# Altium project novena_evt1.PrjPcb (part 4 of 4)

## Sheet 15fpga.SchDoc
size C
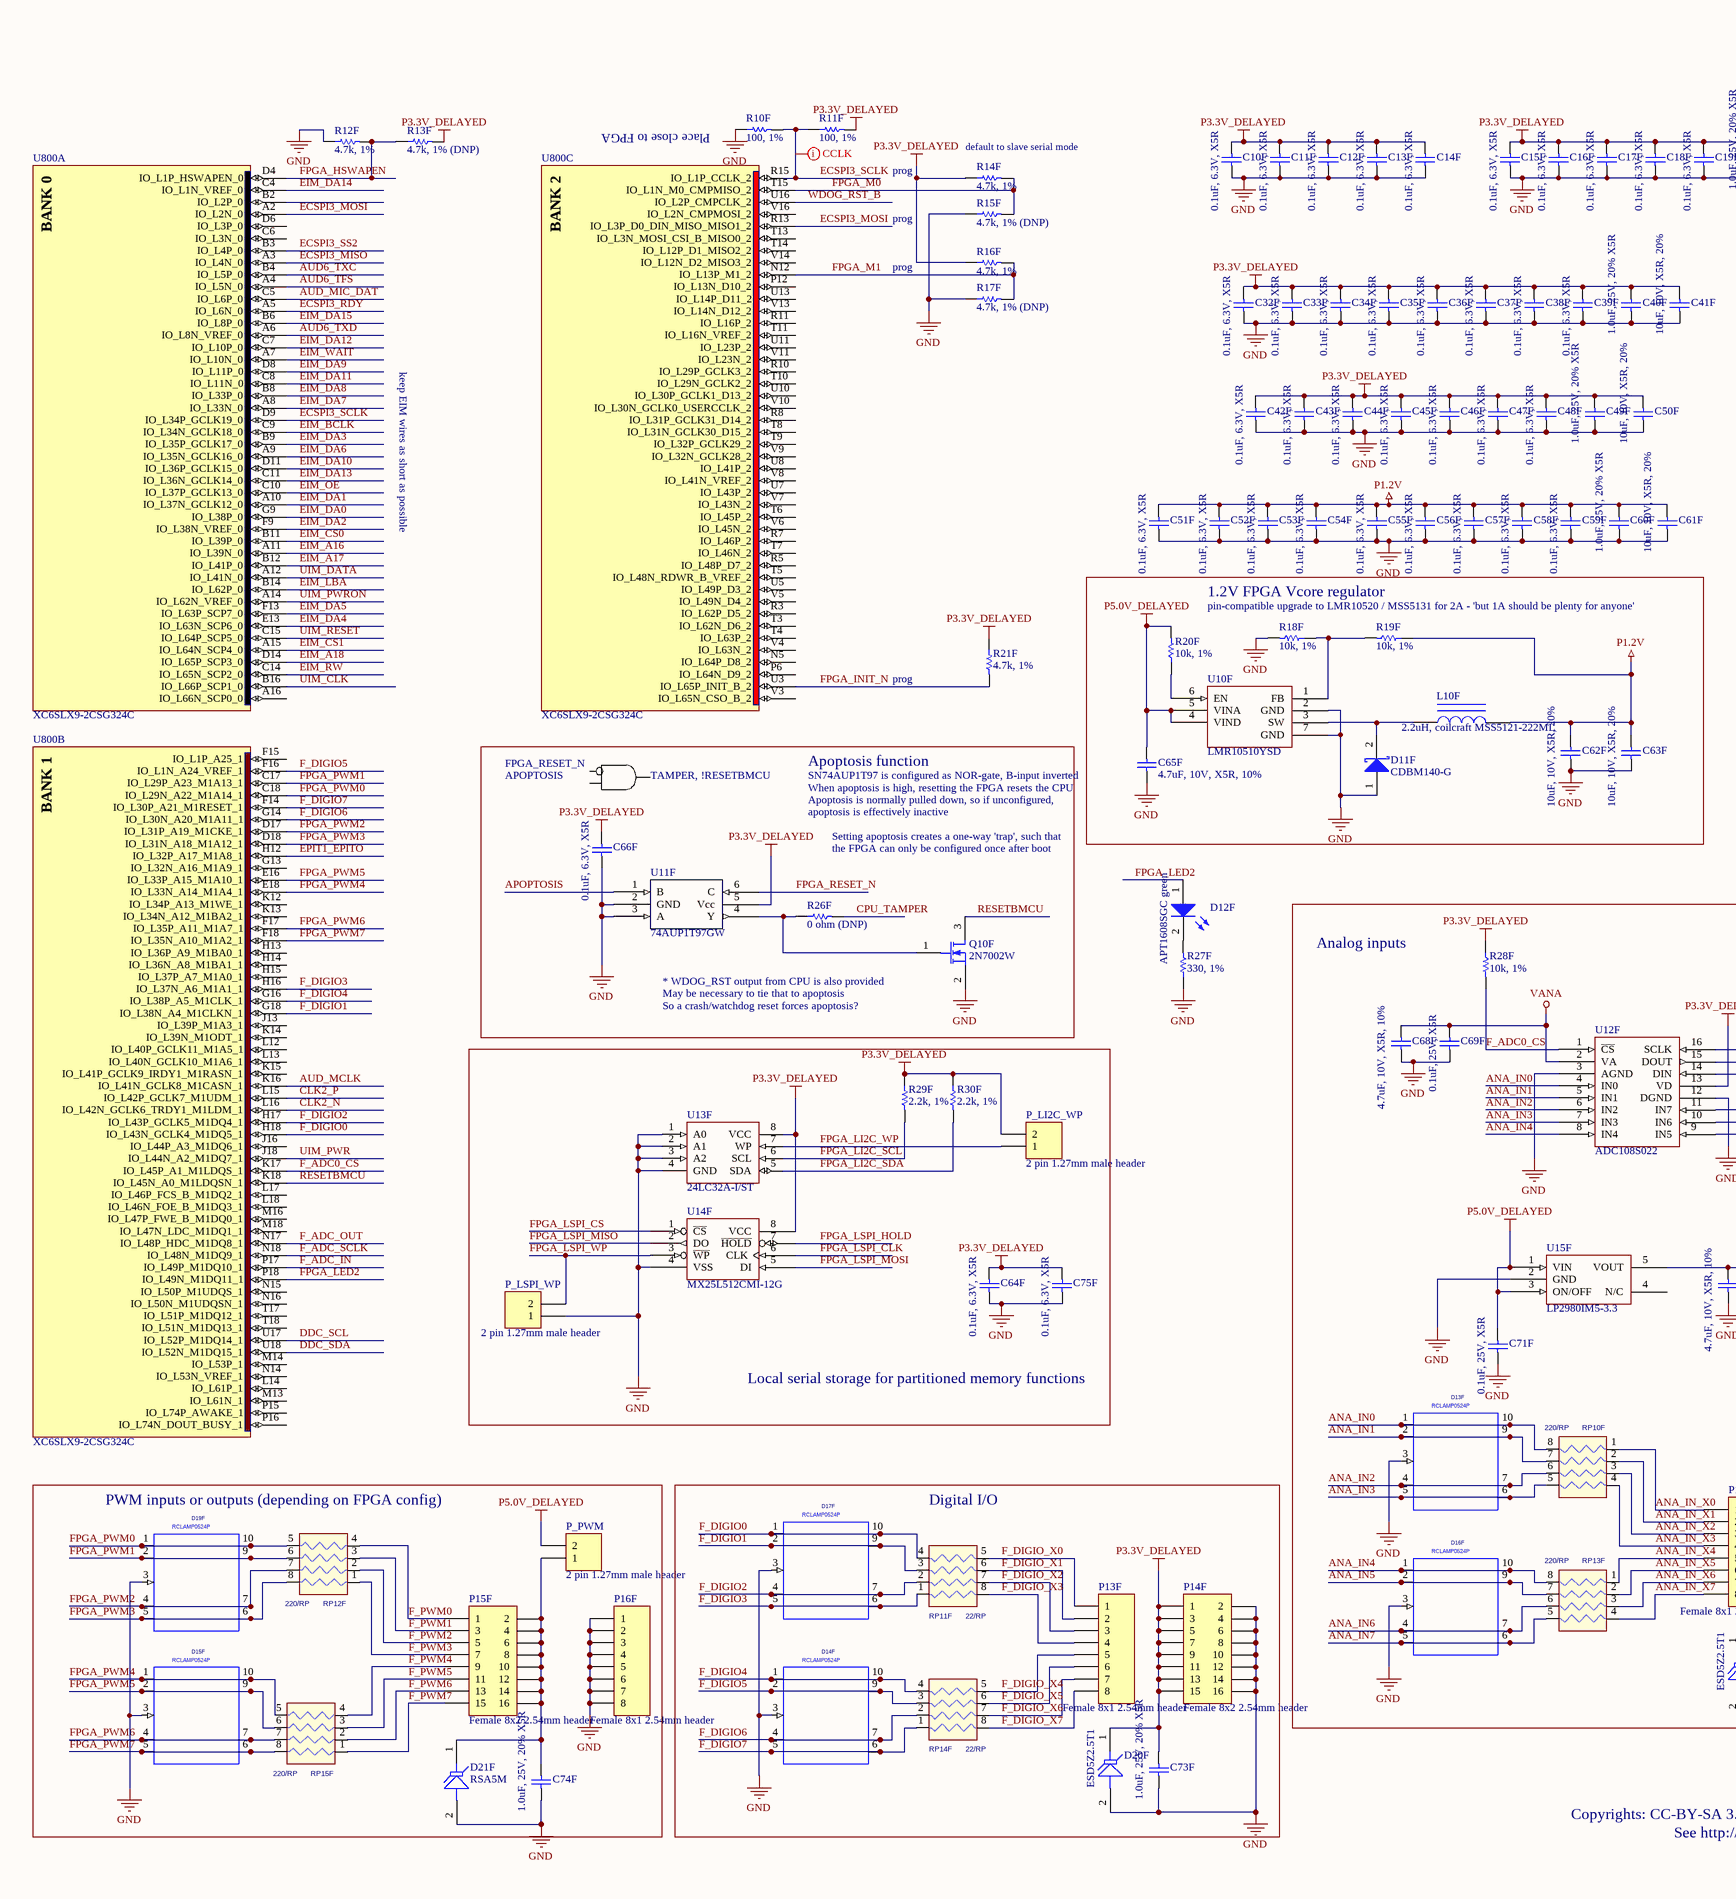
[diagram p16: 15fpga.SchDoc, left]
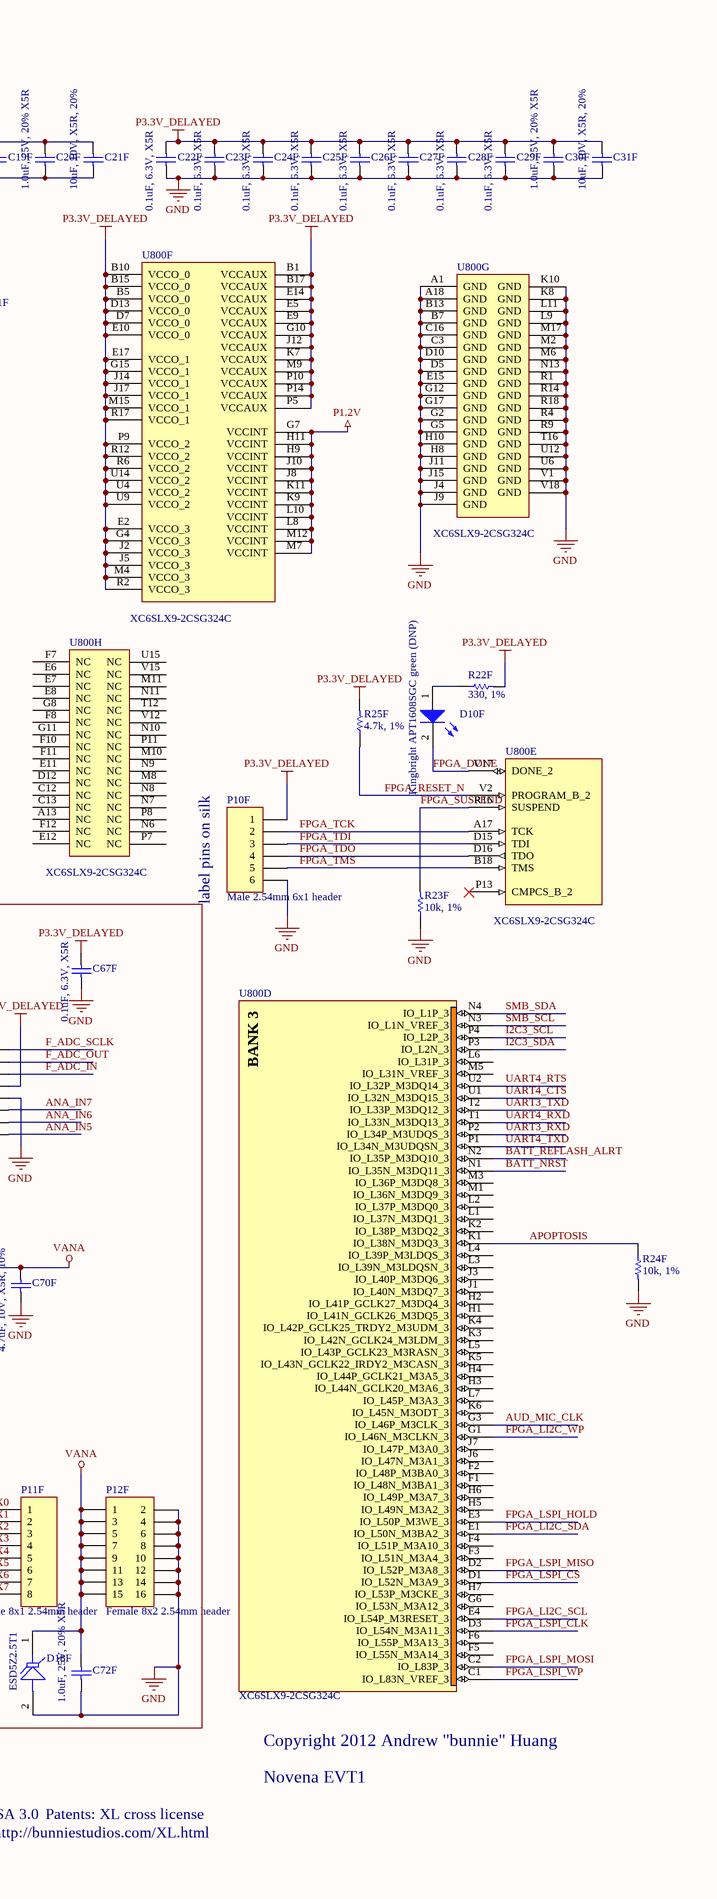
[diagram p17: 15fpga.SchDoc, right]

### Parts
C10F  0.1uF, 6.3V, X5R  [CAPC0603N_B]
C11F  0.1uF, 6.3V, X5R  [CAPC0603N_B]
C12F  0.1uF, 6.3V, X5R  [CAPC0603N_B]
C13F  0.1uF, 6.3V, X5R  [CAPC0603N_B]
C14F  0.1uF, 6.3V, X5R  [CAPC0603N_B]
C15F  0.1uF, 6.3V, X5R  [CAPC0603N_B]
C16F  0.1uF, 6.3V, X5R  [CAPC0603N_B]
C17F  0.1uF, 6.3V, X5R  [CAPC0603N_B]
C18F  0.1uF, 6.3V, X5R  [CAPC0603N_B]
C19F  0.1uF, 6.3V, X5R  [CAPC0603N_B]
C20F  1.0uF, 25V, 20% X5R  [CAPC1608N]
C21F  10uF, 10V, X5R, 20%  [CAPC1608N]
C22F  0.1uF, 6.3V, X5R  [CAPC0603N_B]
C23F  0.1uF, 6.3V, X5R  [CAPC0603N_B]
C24F  0.1uF, 6.3V, X5R  [CAPC0603N_B]
C25F  0.1uF, 6.3V, X5R  [CAPC0603N_B]
C26F  0.1uF, 6.3V, X5R  [CAPC0603N_B]
C27F  0.1uF, 6.3V, X5R  [CAPC0603N_B]
C28F  0.1uF, 6.3V, X5R  [CAPC0603N_B]
C29F  0.1uF, 6.3V, X5R  [CAPC0603N_B]
C30F  1.0uF, 25V, 20% X5R  [CAPC1608N]
C31F  10uF, 10V, X5R, 20%  [CAPC1608N]
C32F  0.1uF, 6.3V, X5R  [CAPC0603N_B]
C33F  0.1uF, 6.3V, X5R  [CAPC0603N_B]
C34F  0.1uF, 6.3V, X5R  [CAPC0603N_B]
C35F  0.1uF, 6.3V, X5R  [CAPC0603N_B]
C36F  0.1uF, 6.3V, X5R  [CAPC0603N_B]
C37F  0.1uF, 6.3V, X5R  [CAPC0603N_B]
C38F  0.1uF, 6.3V, X5R  [CAPC0603N_B]
C39F  0.1uF, 6.3V, X5R  [CAPC0603N_B]
C40F  1.0uF, 25V, 20% X5R  [CAPC1608N]
C41F  10uF, 10V, X5R, 20%  [CAPC1608N]
C42F  0.1uF, 6.3V, X5R  [CAPC0603N_B]
C43F  0.1uF, 6.3V, X5R  [CAPC0603N_B]
C44F  0.1uF, 6.3V, X5R  [CAPC0603N_B]
C45F  0.1uF, 6.3V, X5R  [CAPC0603N_B]
C46F  0.1uF, 6.3V, X5R  [CAPC0603N_B]
C47F  0.1uF, 6.3V, X5R  [CAPC0603N_B]
C48F  0.1uF, 6.3V, X5R  [CAPC0603N_B]
C49F  1.0uF, 25V, 20% X5R  [CAPC1608N]
C50F  10uF, 10V, X5R, 20%  [CAPC1608N]
C51F  0.1uF, 6.3V, X5R  [CAPC0603N_B]
C52F  0.1uF, 6.3V, X5R  [CAPC0603N_B]
C53F  0.1uF, 6.3V, X5R  [CAPC0603N_B]
C54F  0.1uF, 6.3V, X5R  [CAPC0603N_B]
C55F  0.1uF, 6.3V, X5R  [CAPC0603N_B]
C56F  0.1uF, 6.3V, X5R  [CAPC0603N_B]
C57F  0.1uF, 6.3V, X5R  [CAPC0603N_B]
C58F  0.1uF, 6.3V, X5R  [CAPC0603N_B]
C59F  0.1uF, 6.3V, X5R  [CAPC0603N_B]
C60F  1.0uF, 25V, 20% X5R  [CAPC1608N]
C61F  10uF, 10V, X5R, 20%  [CAPC1608N]
C62F  10uF, 10V, X5R, 20%  [CAPC1608N]
C63F  10uF, 10V, X5R, 20%  [CAPC1608N]
C64F  0.1uF, 6.3V, X5R  [CAPC0603N_B]
C65F  4.7uF, 10V, X5R, 10%  [CAPC1608N]
C66F  0.1uF, 6.3V, X5R  [CAPC0603N_B]
C67F  0.1uF, 6.3V, X5R  [CAPC0603N_B]
C68F  4.7uF, 10V, X5R, 10%  [CAPC1608N]
C69F  0.1uF, 25V, X5R  [CAPC1005N]
C70F  4.7uF, 10V, X5R, 10%  [CAPC1608N]
C71F  0.1uF, 25V, X5R  [CAPC1005N]
C72F  1.0uF, 25V, 20% X5R  [CAPC1608N]
C73F  1.0uF, 25V, 20% X5R  [CAPC1608N]
C74F  1.0uF, 25V, 20% X5R  [CAPC1608N]
C75F  0.1uF, 6.3V, X5R  [CAPC0603N_B]
D10F  Kingbright APT1608SGC green (DNP)  [CD1608-0603]
D11F  CDBM140-G  [SOD123]
D12F  APT1608SGC green  [CD1608-0603]
D13F  RCLAMP0524P  [SEMTECH_SLP2510P8]  (value not drawn)
D14F  RCLAMP0524P  [SEMTECH_SLP2510P8]  (value not drawn)
D15F  RCLAMP0524P  [SEMTECH_SLP2510P8]  (value not drawn)
D16F  RCLAMP0524P  [SEMTECH_SLP2510P8]  (value not drawn)
D17F  RCLAMP0524P  [SEMTECH_SLP2510P8]  (value not drawn)
D18F  ESD5Z2.5T1  [SOD-523]
D19F  RCLAMP0524P  [SEMTECH_SLP2510P8]  (value not drawn)
D20F  ESD5Z2.5T1  [SOD-523]
D21F  RSA5M  [SOD123/X.85]
L10F  2.2uH, coilcraft MSS5121-222ML  [COILCRAFT_MSS5121]
P10F  Male 2.54mm 6x1 header  [HDR1X6]
P11F  Female 8x1 2.54mm header  [HDR1X8]
P12F  Female 8x2 2.54mm header  [HDR2X8]
P13F  Female 8x1 2.54mm header  [HDR1X8]
P14F  Female 8x2 2.54mm header  [HDR2X8]
P15F  Female 8x2 2.54mm header  [HDR2X8]
P16F  Female 8x1 2.54mm header  [HDR1X8]
P_LI2C_WP  2 pin 1.27mm male header  [HEADER_2_1.27MM]
P_LSPI_WP  2 pin 1.27mm male header  [HEADER_2_1.27MM]
P_PWM  2 pin 1.27mm male header  [HEADER_2_1.27MM]
Q10F  2N7002W  [SOT323-3AN]
R10F  100, 1%  [RESC1005N]
R11F  100, 1%  [RESC1005N]
R12F  4.7k, 1%  [RESC1005N]
R13F  4.7k, 1% (DNP)  [RESC1005N]
R14F  4.7k, 1%  [RESC1005N]
R15F  4.7k, 1% (DNP)  [RESC1005N]
R16F  4.7k, 1%  [RESC1005N]
R17F  4.7k, 1% (DNP)  [RESC1005N]
R18F  10k, 1%  [RESC1005N]
R19F  10k, 1%  [RESC1005N]
R20F  10k, 1%  [RESC1005N]
R21F  4.7k, 1%  [RESC1005N]
R22F  330, 1%  [RESC1005N]
R23F  10k, 1%  [RESC1005N]
R24F  10k, 1%  [RESC1005N]
R25F  4.7k, 1%  [RESC1005N]
R26F  0 ohm (DNP)  [RESC1005N]
R27F  330, 1%  [RESC1005N]
R28F  10k, 1%  [RESC1005N]
R29F  2.2k, 1%  [RESC1005N]
R30F  2.2k, 1%  [RESC1005N]
RP10F  220/RP  [PANASONIC_EXB28V]
RP11F  22/RP  [PANASONIC_EXB28V]
RP12F  220/RP  [PANASONIC_EXB28V]
RP13F  220/RP  [PANASONIC_EXB28V]
RP14F  22/RP  [PANASONIC_EXB28V]
RP15F  220/RP  [PANASONIC_EXB28V]
U10F  LMR10510YSD  [SON95P300X300X80-7V]
U11F  74AUP1T97GW  [SOT363-6N]
U12F  ADC108S022  [SOP65P640-16N]
U13F  24LC32A-I/ST  [TSOP65P640-8AN]
U14F  MX25L512CMI-12G  [SOIC127P600-8AN]
U15F  LP2980IM5-3.3  [SOT23-5AN]
U800  XC6SLX9-2CSG324C  [CSG324]  (parts A,B,C,D,E,F,G,H of 8)

### Blocks framed on the sheet
1.2V FPGA Vcore regulator: C62F C63F C65F D11F L10F R18F R19F R20F U10F
Apoptosis function: C66F Q10F R26F U11F
Analog inputs: C67F C68F C69F C70F C71F C72F D13F D16F D18F P11F P12F R28F RP10F RP13F U12F U15F
Local serial storage for partitioned memory functions: C64F C75F P_LI2C_WP P_LSPI_WP R29F R30F U13F U14F
PWM inputs or outputs (depending on FPGA config): C74F D15F D19F D21F P15F P16F P_PWM RP12F RP15F
Digital I/O: C73F D14F D17F D20F P13F P14F RP11F RP14F

### Nets
GND: C10F.2 C11F.2 C12F.2 C13F.2 C14F.2 C15F.2 C16F.2 C17F.2 C18F.2 C19F.2 C20F.1 C21F.2 C22F.2 C23F.2 C24F.2 C25F.2 C26F.2 C27F.2 C28F.2 C29F.2 C30F.1 C31F.2 C32F.2 C33F.2 C34F.2 C35F.2 C36F.2 C37F.2 C38F.2 C39F.2 C40F.1 C41F.2 C42F.2 C43F.2 C44F.2 C45F.2 C46F.2 C47F.2 C48F.2 C49F.1 C50F.2 C51F.2 C52F.2 C53F.2 C54F.2 C55F.2 C56F.2 C57F.2 C58F.2 C59F.2 C60F.1 C61F.2 C62F.1 C63F.1 C64F.2 C65F.2 C66F.2 C67F.2 C68F.2 C69F.2 C70F.2 C71F.2 C72F.1 C73F.1 C74F.1 C75F.2 D11F.1(A) D13F.3(GND1) D14F.3(GND1) D15F.3(GND1) D16F.3(GND1) D17F.3(GND1) D18F.2(A) D19F.3(GND1) D20F.2(A) D21F.2(A) P10F.6 P12F.2 P12F.4 P12F.6 P12F.8 P12F.10 P12F.12 P12F.14 P12F.16 P14F.2 P14F.4 P14F.6 P14F.8 P14F.10 P14F.12 P14F.14 P14F.16 P16F.1 P16F.2 P16F.3 P16F.4 P16F.5 P16F.6 P16F.7 P16F.8 P_LSPI_WP.1 Q10F.2(S) R10F.1 R12F.1 R15F.1 R17F.1 R18F.2 R23F.1 R24F.2 R27F.1 U10F.2(GND) U10F.7(GND) U11F.2(GND) U11F.3(A) U12F.3(AGND) U12F.12(DGND) U13F.1(A0) U13F.2(A1) U13F.3(A2) U13F.4(GND) U14F.4(VSS) U15F.2(GND) U800.A1(GND) U800.A18(GND) U800.B7(GND) U800.B13(GND) U800.C3(GND) U800.C16(GND) U800.D5(GND) U800.D10(GND) U800.E15(GND) U800.G2(GND) U800.G5(GND) U800.G12(GND) U800.G17(GND) U800.H8(GND) U800.H10(GND) U800.J4(GND) U800.J9(GND) U800.J11(GND) U800.J15(GND) U800.K8(GND) U800.K10(GND) U800.L9(GND) U800.L11(GND) U800.M2(GND) U800.M6(GND) U800.M17(GND) U800.N13(GND) U800.R1(GND) U800.R4(GND) U800.R9(GND) U800.R14(GND) U800.R18(GND) U800.T16(GND) U800.U6(GND) U800.U12(GND) U800.V1(GND) U800.V18(GND)
P1.2V: C51F.1 C52F.1 C53F.1 C54F.1 C55F.1 C56F.1 C57F.1 C58F.1 C59F.1 C60F.2 C61F.1 C62F.2 C63F.2 L10F.2 R19F.1 U800.G7(VCCINT) U800.H9(VCCINT) U800.H11(VCCINT) U800.J8(VCCINT) U800.J10(VCCINT) U800.K9(VCCINT) U800.K11(VCCINT) U800.L8(VCCINT) U800.L10(VCCINT) U800.M7(VCCINT) U800.M12(VCCINT)
P3.3V_DELAYED: C10F.1 C11F.1 C12F.1 C13F.1 C14F.1 C15F.1 C16F.1 C17F.1 C18F.1 C19F.1 C20F.2 C21F.1 C22F.1 C23F.1 C24F.1 C25F.1 C26F.1 C27F.1 C28F.1 C29F.1 C30F.2 C31F.1 C32F.1 C33F.1 C34F.1 C35F.1 C36F.1 C37F.1 C38F.1 C39F.1 C40F.2 C41F.1 C42F.1 C43F.1 C44F.1 C45F.1 C46F.1 C47F.1 C48F.1 C49F.2 C50F.1 C64F.1 C66F.1 C67F.1 C73F.2 C75F.1 D20F.1(K) P10F.1 P14F.1 P14F.3 P14F.5 P14F.7 P14F.9 P14F.11 P14F.13 P14F.15 P_LI2C_WP.2 R11F.2 R13F.2 R14F.1 R16F.1 R21F.1 R22F.2 R25F.2 R28F.1 R29F.1 R30F.1 U11F.5(Vcc) U12F.13(VD) U13F.8(VCC) U14F.8(VCC) U800.B1(VCCAUX) U800.B5(VCCO_0) U800.B10(VCCO_0) U800.B15(VCCO_0) U800.B17(VCCAUX) U800.D7(VCCO_0) U800.D13(VCCO_0) U800.E2(VCCO_3) U800.E5(VCCAUX) U800.E9(VCCAUX) U800.E10(VCCO_0) U800.E14(VCCAUX) U800.E17(VCCO_1) U800.G4(VCCO_3) U800.G10(VCCAUX) U800.G15(VCCO_1) U800.J2(VCCO_3) U800.J5(VCCO_3) U800.J12(VCCAUX) U800.J14(VCCO_1) U800.J17(VCCO_1) U800.K7(VCCAUX) U800.M4(VCCO_3) U800.M9(VCCAUX) U800.M15(VCCO_1) U800.P5(VCCAUX) U800.P9(VCCO_2) U800.P10(VCCAUX) U800.P14(VCCAUX) U800.R2(VCCO_3) U800.R6(VCCO_2) U800.R12(VCCO_2) U800.R17(VCCO_1) U800.U4(VCCO_2) U800.U9(VCCO_2) U800.U14(VCCO_2)
P5.0V_DELAYED: C65F.1 C71F.1 P_PWM.2 R20F.2 U10F.4(VIND) U10F.5(VINA) U15F.1(VIN) U15F.3(ON/OFF)
VANA: C68F.1 C69F.1 C70F.1 C72F.2 D18F.1(K) P12F.1 P12F.3 P12F.5 P12F.7 P12F.9 P12F.11 P12F.13 P12F.15 U12F.2(VA) U15F.5(VOUT)
ANA_IN0: D13F.1(IO1A) D13F.10(IO1B) RP10F.8(R12) U12F.4(IN0)
ANA_IN1: D13F.2(IO2A) D13F.9(IO2B) RP10F.7(R22) U12F.5(IN1)
ANA_IN2: D13F.4(IO3A) D13F.7(IO3B) RP10F.6(R32) U12F.6(IN2)
ANA_IN3: D13F.5(IO4A) D13F.6(IO4B) RP10F.5(R42) U12F.7(IN3)
ANA_IN4: D16F.1(IO1A) D16F.10(IO1B) RP13F.8(R12) U12F.8(IN4)
ANA_IN5: D16F.2(IO2A) D16F.9(IO2B) RP13F.7(R22) U12F.9(IN5)
ANA_IN6: D16F.4(IO3A) D16F.7(IO3B) RP13F.6(R32) U12F.10(IN6)
ANA_IN7: D16F.5(IO4A) D16F.6(IO4B) RP13F.5(R42) U12F.11(IN7)
ANA_IN_X0: P11F.1 RP10F.1(R1)
ANA_IN_X1: P11F.2 RP10F.2(R2)
ANA_IN_X2: P11F.3 RP10F.3(R3)
ANA_IN_X3: P11F.4 RP10F.4(R4)
ANA_IN_X4: P11F.5 RP13F.1(R1)
ANA_IN_X5: P11F.6 RP13F.2(R2)
ANA_IN_X6: P11F.7 RP13F.3(R3)
ANA_IN_X7: P11F.8 RP13F.4(R4)
APOPTOSIS: R24F.1 U11F.1(B) U800.K1(IO_L38N_M3DQ3_3)
AUD6_TFS: U800.A4(IO_L5N_0)
AUD6_TXC: U800.B4(IO_L5P_0)
AUD6_TXD: U800.A6(IO_L8N_VREF_0)
AUD_MCLK: U800.K16(IO_L41N_GCLK8_M1CASN_1)
AUD_MIC_CLK: U800.G3(IO_L46P_M3CLK_3)
AUD_MIC_DAT: U800.C5(IO_L6P_0)
BATT_NRST: U800.N1(IO_L35N_M3DQ11_3)
BATT_REFLASH_ALRT: U800.N2(IO_L35P_M3DQ10_3)
CLK2_N: U800.L16(IO_L42N_GCLK6_TRDY1_M1LDM_1)
CLK2_P: U800.L15(IO_L42P_GCLK7_M1UDM_1)
CPU_TAMPER: R26F.2
DDC_SCL: U800.U17(IO_L52P_M1DQ14_1)
DDC_SDA: U800.U18(IO_L52N_M1DQ15_1)
ECSPI3_MISO: U800.A3(IO_L4N_0)
ECSPI3_MOSI: U800.A2(IO_L2N_0) U800.R13(IO_L3P_D0_DIN_MISO_MISO1_2)
ECSPI3_RDY: U800.A5(IO_L6N_0)
ECSPI3_SCLK: R10F.2 R11F.1 U800.D9(IO_L34P_GCLK19_0) U800.R15(IO_L1P_CCLK_2)
ECSPI3_SS2: U800.B3(IO_L4P_0)
EIM_A16: U800.A11(IO_L39N_0)
EIM_A17: U800.B12(IO_L41P_0)
EIM_A18: U800.D14(IO_L65P_SCP3_0)
EIM_BCLK: U800.C9(IO_L34N_GCLK18_0)
EIM_CS0: U800.B11(IO_L39P_0)
EIM_CS1: U800.A15(IO_L64N_SCP4_0)
EIM_DA0: U800.G9(IO_L38P_0)
EIM_DA1: U800.A10(IO_L37N_GCLK12_0)
EIM_DA2: U800.F9(IO_L38N_VREF_0)
EIM_DA3: U800.B9(IO_L35P_GCLK17_0)
EIM_DA4: U800.E13(IO_L63N_SCP6_0)
EIM_DA5: U800.F13(IO_L63P_SCP7_0)
EIM_DA6: U800.A9(IO_L35N_GCLK16_0)
EIM_DA7: U800.A8(IO_L33N_0)
EIM_DA8: U800.B8(IO_L33P_0)
EIM_DA9: U800.D8(IO_L11P_0)
EIM_DA10: U800.D11(IO_L36P_GCLK15_0)
EIM_DA11: U800.C8(IO_L11N_0)
EIM_DA12: U800.C7(IO_L10P_0)
EIM_DA13: U800.C11(IO_L36N_GCLK14_0)
EIM_DA14: U800.C4(IO_L1N_VREF_0)
EIM_DA15: U800.B6(IO_L8P_0)
EIM_LBA: U800.B14(IO_L62P_0)
EIM_OE: U800.C10(IO_L37P_GCLK13_0)
EIM_RW: U800.C14(IO_L65N_SCP2_0)
EIM_WAIT: U800.A7(IO_L10N_0)
EPIT1_EPITO: U800.H12(IO_L32P_A17_M1A8_1)
F_ADC0_CS: R28F.2 U12F.1(~{CS}) U800.K17(IO_L45P_A1_M1LDQS_1)
F_ADC_IN: U12F.14(DIN) U800.P17(IO_L49P_M1DQ10_1)
F_ADC_OUT: U12F.15(DOUT) U800.N17(IO_L48P_HDC_M1DQ8_1)
F_ADC_SCLK: U12F.16(SCLK) U800.N18(IO_L48N_M1DQ9_1)
F_DIGIO0: D17F.1(IO1A) D17F.10(IO1B) RP11F.4(R4) U800.H18(IO_L43N_GCLK4_M1DQ5_1)
F_DIGIO1: D17F.2(IO2A) D17F.9(IO2B) RP11F.3(R3) U800.G18(IO_L38N_A4_M1CLKN_1)
F_DIGIO2: D17F.4(IO3A) D17F.7(IO3B) RP11F.2(R2) U800.H17(IO_L43P_GCLK5_M1DQ4_1)
F_DIGIO3: D17F.5(IO4A) D17F.6(IO4B) RP11F.1(R1) U800.H16(IO_L37N_A6_M1A1_1)
F_DIGIO4: D14F.1(IO1A) D14F.10(IO1B) RP14F.4(R4) U800.G16(IO_L38P_A5_M1CLK_1)
F_DIGIO5: D14F.2(IO2A) D14F.9(IO2B) RP14F.3(R3) U800.F16(IO_L1N_A24_VREF_1)
F_DIGIO6: D14F.4(IO3A) D14F.7(IO3B) RP14F.2(R2) U800.G14(IO_L30N_A20_M1A11_1)
F_DIGIO7: D14F.5(IO4A) D14F.6(IO4B) RP14F.1(R1) U800.F14(IO_L30P_A21_M1RESET_1)
F_DIGIO_X0: P13F.1 RP11F.5(R42)
F_DIGIO_X1: P13F.2 RP11F.6(R32)
F_DIGIO_X2: P13F.3 RP11F.7(R22)
F_DIGIO_X3: P13F.4 RP11F.8(R12)
F_DIGIO_X4: P13F.5 RP14F.5(R42)
F_DIGIO_X5: P13F.6 RP14F.6(R32)
F_DIGIO_X6: P13F.7 RP14F.7(R22)
F_DIGIO_X7: P13F.8 RP14F.8(R12)
F_PWM0: P15F.1 RP12F.4(R4)
F_PWM1: P15F.3 RP12F.3(R3)
F_PWM2: P15F.5 RP12F.2(R2)
F_PWM3: P15F.7 RP12F.1(R1)
F_PWM4: P15F.9 RP15F.4(R4)
F_PWM5: P15F.11 RP15F.3(R3)
F_PWM6: P15F.13 RP15F.2(R2)
F_PWM7: P15F.15 RP15F.1(R1)
FPGA_DONE: D10F.2(K) U800.V17(DONE_2)
FPGA_HSWAPEN: R12F.2 R13F.1 U800.D4(IO_L1P_HSWAPEN_0)
FPGA_INIT_N: R21F.2 U800.U3(IO_L65P_INIT_B_2)
FPGA_LED2: D12F.1(A) U800.P18(IO_L49N_M1DQ11_1)
FPGA_LI2C_SCL: R29F.2 U13F.6(SCL) U800.E4(IO_L54P_M3RESET_3)
FPGA_LI2C_SDA: R30F.2 U13F.5(SDA) U800.E1(IO_L50N_M3BA2_3)
FPGA_LI2C_WP: P_LI2C_WP.1 U13F.7(WP) U800.G1(IO_L46N_M3CLKN_3)
FPGA_LSPI_CLK: U14F.6(CLK) U800.D3(IO_L54N_M3A11_3)
FPGA_LSPI_CS: U14F.1(~{CS}) U800.D1(IO_L52N_M3A9_3)
FPGA_LSPI_HOLD: U14F.7(~{HOLD}) U800.E3(IO_L50P_M3WE_3)
FPGA_LSPI_MISO: U14F.2(DO) U800.D2(IO_L52P_M3A8_3)
FPGA_LSPI_MOSI: U14F.5(DI) U800.C2(IO_L83P_3)
FPGA_LSPI_WP: P_LSPI_WP.2 U14F.3(~{WP}) U800.C1(IO_L83N_VREF_3)
FPGA_M0: R14F.2 R15F.2 U800.T15(IO_L1N_M0_CMPMISO_2)
FPGA_M1: R16F.2 R17F.2 U800.N12(IO_L13P_M1_2)
FPGA_PWM0: D19F.1(IO1A) D19F.10(IO1B) RP12F.5(R42) U800.C18(IO_L29N_A22_M1A14_1)
FPGA_PWM1: D19F.2(IO2A) D19F.9(IO2B) RP12F.6(R32) U800.C17(IO_L29P_A23_M1A13_1)
FPGA_PWM2: D19F.4(IO3A) D19F.7(IO3B) RP12F.7(R22) U800.D17(IO_L31P_A19_M1CKE_1)
FPGA_PWM3: D19F.5(IO4A) D19F.6(IO4B) RP12F.8(R12) U800.D18(IO_L31N_A18_M1A12_1)
FPGA_PWM4: D15F.1(IO1A) D15F.10(IO1B) RP15F.5(R42) U800.E18(IO_L33N_A14_M1A4_1)
FPGA_PWM5: D15F.2(IO2A) D15F.9(IO2B) RP15F.6(R32) U800.E16(IO_L33P_A15_M1A10_1)
FPGA_PWM6: D15F.4(IO3A) D15F.7(IO3B) RP15F.7(R22) U800.F17(IO_L35P_A11_M1A7_1)
FPGA_PWM7: D15F.5(IO4A) D15F.6(IO4B) RP15F.8(R12) U800.F18(IO_L35N_A10_M1A2_1)
FPGA_RESET_N: R25F.1 U11F.6(C) U800.V2(PROGRAM_B_2)
FPGA_SUSPEND: R23F.2 U800.R16(SUSPEND)
FPGA_TCK: P10F.2 U800.A17(TCK)
FPGA_TDI: P10F.3 U800.D15(TDI)
FPGA_TDO: P10F.4 U800.D16(TDO)
FPGA_TMS: P10F.5 U800.B18(TMS)
I2C3_SCL: U800.P4(IO_L2P_3)
I2C3_SDA: U800.P3(IO_L2N_3)
RESETBMCU: Q10F.3(D) U800.K18(IO_L45N_A0_M1LDQSN_1)
SMB_SCL: U800.N3(IO_L1N_VREF_3)
SMB_SDA: U800.N4(IO_L1P_3)
UART3_RXD: U800.P2(IO_L34P_M3UDQS_3)
UART3_TXD: U800.T2(IO_L33P_M3DQ12_3)
UART4_CTS: U800.U1(IO_L32N_M3DQ15_3)
UART4_RTS: U800.U2(IO_L32P_M3DQ14_3)
UART4_RXD: U800.T1(IO_L33N_M3DQ13_3)
UART4_TXD: U800.P1(IO_L34N_M3UDQSN_3)
UIM_CLK: U800.B16(IO_L66P_SCP1_0)
UIM_DATA: U800.A12(IO_L41N_0)
UIM_PWR: U800.J18(IO_L44N_A2_M1DQ7_1)
UIM_PWRON: U800.A14(IO_L62N_VREF_0)
UIM_RESET: U800.C15(IO_L64P_SCP5_0)
WDOG_RST_B: U800.U16(IO_L2P_CMPCLK_2)
NetC74F_2: C74F.2 D21F.1(K) P15F.2 P15F.4 P15F.6 P15F.8 P15F.10 P15F.12 P15F.14 P15F.16 P_PWM.1
NetD10F_1: D10F.1(A) R22F.1
NetD11F_2: D11F.2(K) L10F.1 U10F.3(SW)
NetD12F_2: D12F.2(K) R27F.2
NetQ10F_1: Q10F.1(G) R26F.1 U11F.4(Y)
NetR18F_1: R18F.1 R19F.2 U10F.1(FB)
NetR20F_1: R20F.1 U10F.6(EN)

Not connected (* = marked no-connect by the designer): U15F 4(N/C); U800 A13(NC) A16(IO_L66N_SCP0_0) B2(IO_L2P_0) C6(IO_L3N_0) C12(NC) C13(NC) D6(IO_L3P_0) D12(NC) E6(NC) E7(NC) E8(NC) E11(NC) E12(NC) F1(IO_L48N_M3BA1_3) F2(IO_L48P_M3BA0_3) F3(IO_L51N_M3A4_3) F4(IO_L51P_M3A10_3) F5(IO_L55N_M3A14_3) F6(IO_L55P_M3A13_3) F7(NC) F8(NC) F10(NC) F11(NC) F12(NC) F15(IO_L1P_A25_1) G6(IO_L53N_M3A12_3) G8(NC) G11(NC) G13(IO_L32N_A16_M1A9_1) H1(IO_L41N_GCLK26_M3DQ5_3) H2(IO_L41P_GCLK27_M3DQ4_3) H3(IO_L44N_GCLK20_M3A6_3) H4(IO_L44P_GCLK21_M3A5_3) H5(IO_L49N_M3A2_3) H6(IO_L49P_M3A7_3) H7(IO_L53P_M3CKE_3) H13(IO_L36P_A9_M1BA0_1) H14(IO_L36N_A8_M1BA1_1) H15(IO_L37P_A7_M1A0_1) J1(IO_L40N_M3DQ7_3) J3(IO_L40P_M3DQ6_3) J6(IO_L47N_M3A1_3) J7(IO_L47P_M3A0_3) J13(IO_L39P_M1A3_1) J16(IO_L44P_A3_M1DQ6_1) K2(IO_L38P_M3DQ2_3) K3(IO_L42N_GCLK24_M3LDM_3) K4(IO_L42P_GCLK25_TRDY2_M3UDM_3) K5(IO_L43N_GCLK22_IRDY2_M3CASN_3) K6(IO_L45N_M3ODT_3) K12(IO_L34P_A13_M1WE_1) K13(IO_L34N_A12_M1BA2_1) K14(IO_L39N_M1ODT_1) K15(IO_L41P_GCLK9_IRDY1_M1RASN_1) L1(IO_L37N_M3DQ1_3) L2(IO_L37P_M3DQ0_3) L3(IO_L39N_M3LDQSN_3) L4(IO_L39P_M3LDQS_3) L5(IO_L43P_GCLK23_M3RASN_3) L6(IO_L31P_3) L7(IO_L45P_M3A3_3) L12(IO_L40P_GCLK11_M1A5_1) L13(IO_L40N_GCLK10_M1A6_1) L14(IO_L61P_1) L17(IO_L46P_FCS_B_M1DQ2_1) L18(IO_L46N_FOE_B_M1DQ3_1) M1(IO_L36N_M3DQ9_3) M3(IO_L36P_M3DQ8_3) M5(IO_L31N_VREF_3) M8(NC) M10(NC) M11(NC) M13(IO_L61N_1) M14(IO_L53P_1) M16(IO_L47P_FWE_B_M1DQ0_1) M18(IO_L47N_LDC_M1DQ1_1) N5(IO_L64P_D8_2) N6(NC) N7(NC) N8(NC) N9(NC) N10(NC) N11(NC) N14(IO_L53N_VREF_1) N15(IO_L50P_M1UDQS_1) N16(IO_L50N_M1UDQSN_1) P6(IO_L64N_D9_2) P7(NC) P8(NC) P11(NC) P12(IO_L13N_D10_2) P13(CMPCS_B_2)* P15(IO_L74P_AWAKE_1) P16(IO_L74N_DOUT_BUSY_1) R3(IO_L62P_D5_2) R5(IO_L48P_D7_2) R7(IO_L46P_2) R8(IO_L31P_GCLK31_D14_2) R10(IO_L29P_GCLK3_2) R11(IO_L16P_2) T3(IO_L62N_D6_2) T4(IO_L63P_2) T5(IO_L48N_RDWR_B_VREF_2) T6(IO_L45P_2) T7(IO_L46N_2) T8(IO_L31N_GCLK30_D15_2) T9(IO_L32P_GCLK29_2) T10(IO_L29N_GCLK2_2) T11(IO_L16N_VREF_2) T12(NC) T13(IO_L3N_MOSI_CSI_B_MISO0_2) T14(IO_L12P_D1_MISO2_2) T17(IO_L51P_M1DQ12_1) T18(IO_L51N_M1DQ13_1) U5(IO_L49P_D3_2) U7(IO_L43P_2) U8(IO_L41P_2) U10(IO_L30P_GCLK1_D13_2) U11(IO_L23P_2) U13(IO_L14P_D11_2) U15(NC) V3(IO_L65N_CSO_B_2) V4(IO_L63N_2) V5(IO_L49N_D4_2) V6(IO_L45N_2) V7(IO_L43N_2) V8(IO_L41N_VREF_2) V9(IO_L32N_GCLK28_2) V10(IO_L30N_GCLK0_USERCCLK_2) V11(IO_L23N_2) V12(NC) V13(IO_L14N_D12_2) V14(IO_L12N_D2_MISO3_2) V15(NC) V16(IO_L2N_CMPMOSI_2)

### Layout directives
net class CCLK: ECSPI3_SCLK

### Notes on the sheet
- (near R10F) Place close to FPGA
- (near R14F) default to slave serial mode
- prog
- keep EIM wires as short as possible
- pin-compatible upgrade to LMR10520 / MSS5131 for 2A - 'but 1A should be plenty for anyone'
- FPGA_RESET_N
- APOPTOSIS
- TAMPER, !RESETBMCU
- (near C65F) SN74AUP1T97 is configured as NOR-gate, B-input inverted
- (near C65F) When apoptosis is high, resetting the FPGA resets the CPU
- Apoptosis is normally pulled down, so if unconfigured,
- apoptosis is effectively inactive
- Setting apoptosis creates a one-way 'trap', such that
- the FPGA can only be configured once after boot
- label pins on silk
- * WDOG_RST output from CPU is also provided
- May be necessary to tie that to apoptosis
- So a crash/watchdog reset forces apoptosis?
- Copyright 2012 Andrew "bunnie" Huang
- Novena EVT1
- Copyrights: CC-BY-SA 3.0
- See http://bunniestudios.com/XL.html
- Patents: XL cross license
- (in symbol XC6SLX9-2CSG324C, part A) BANK 0
- (in symbol XC6SLX9-2CSG324C, part B) BANK 1
- (in symbol XC6SLX9-2CSG324C, part C) BANK 2
- (in symbol XC6SLX9-2CSG324C, part D) BANK 3

### Library data of the parts
C10F C11F C12F C13F C14F C15F C16F C17F C18F C19F C20F C21F C22F C23F C24F C25F C26F C27F C28F C29F C30F C31F C32F C33F C34F C35F C36F C37F C38F C39F C40F C41F C42F C43F C44F C45F C46F C47F C48F C49F C50F C51F C52F C53F C54F C55F C56F C57F C58F C59F C60F C61F C62F C63F C64F C65F C66F C67F C68F C69F C70F C71F C72F C73F C74F C75F = Cap Semi: Capacitor (Semiconductor SIM Model); Published: 8-Jun-2000; LatestRevisionDate: 17-Jul-2002; LatestRevisionNote: Re-released for DXP Platform.; PackageReference: C1206; Publisher: Altium Limited
D10F D12F = LED2: Typical RED, GREEN, YELLOW, AMBER GaAs LED; Published: 8-Jun-2000; LatestRevisionDate: 17-Jul-2002; LatestRevisionNote: Re-released for DXP Platform.; PackageVersion: Feb-2002; PackageReference: 3.2X1.6X1.1; Publisher: Altium Limited
D11F = D Schottky: Schottky Diode; Code - JEDEC: DO-214-AA; Published: 8-Jun-2000; Publisher: Altium Limited; Revision: July-2002: Re-released for DXP Platform.
D13F D14F D15F D16F D17F D19F = RCLAMP0524P: PART_NUMBER: V00004-001; CDS_LMAN_SYM_OUTLINE: -175,225,175,-175; MATERIAL: IC; PACK_TYPE: SLP1610P4; PATH: I24; OriginalSymbolOrigin: (-175,225); LOCATION: D8; XY: (-2475,4175); VER: 1; ROT: 0; PHYS_PAGE: 10; DRAWING: @BROWNSTONE_LIB.BROWNSTONE(SCH_1):PAGE10; CDS_LIB: integrated_circuits; SEC_TYPE: SLP1610P4; SEC: 1; CDS_LOCATION: D8; $LOCATION: D8
D18F D20F = Tranzorb: On Semi 3.3V standoff TVS diode; Published: 24-Mar-1999; LatestRevisionDate: 17-Jul-2002; LatestRevisionNote: Re-released for DXP Platform.; PackageReference: DO-7; Publisher: Altium Limited
D21F = Tranzorb: Published: 24-Mar-1999; LatestRevisionDate: 17-Jul-2002; LatestRevisionNote: Re-released for DXP Platform.; PackageReference: DO-7; Publisher: Altium Limited
L10F = Inductor Iron: Magnetic-Core Inductor; Published: 24-Mar-1999; LatestRevisionDate: 17-Jul-2002; LatestRevisionNote: Re-released for DXP Platform.; PackageReference: AXIAL-0.9; Publisher: Altium Limited
P10F = Header 6: Header, 6-Pin; LatestRevisionDate: 17-Jul-2002; LatestRevisionNote: Re-released for DXP Platform.; Publisher: Altium Limited
P11F P13F P16F = Header 8: Header, 8-Pin; LatestRevisionDate: 17-Jul-2002; LatestRevisionNote: Re-released for DXP Platform.; Publisher: Altium Limited
P12F P14F P15F = Header 8X2: Header, 8-Pin, Dual row; LatestRevisionDate: 17-Jul-2002; LatestRevisionNote: Re-released for DXP Platform.; Publisher: Altium Limited
P_LI2C_WP P_LSPI_WP P_PWM = Header 2: Header, 2-Pin; LatestRevisionDate: 17-Jul-2002; LatestRevisionNote: Re-released for DXP Platform.; Publisher: Altium Limited
Q10F = MOSFET-N: N-Channel MOSFET; Published: 8-Jun-2000; LatestRevisionDate: 17-Jul-2002; LatestRevisionNote: Re-released for DXP Platform.; PackageVersion: 1995/1996; PackageReference: E3; Publisher: Altium Limited
R10F R11F R12F R13F R14F R15F R16F R17F R18F R19F R20F R21F R22F R23F R24F R25F R26F R27F R28F R29F R30F = Res1: Resistor; Value: 100k; Published: 8-Jun-2000; LatestRevisionDate: 17-Jul-2002; LatestRevisionNote: Re-released for DXP Platform.; PackageReference: AXIAL-0.3; Publisher: Altium Limited
RP10F RP11F RP12F RP13F RP14F RP15F = RPACK4
U10F = LMR10515XSD: NatSemi 1.5A step-down regulator in LLP
U11F = SN74AUP1T98DBV: Single-supply voltage translator, multiple logic function
U12F = ADCxx8Sxx2: 12-input SPI ADC, bits & sample rate pin compatible across family
U13F = AT24C08: 8kbit (1kx8) I2C EEPROM
U14F = EN25P05-50GCP: 512 Mbit (64Kbyte) SPI NOR FLASH, Eon Semi
U15F = LP2980M5: 50 mA SOT-23 regulator
U800 = XC6SLX9-2CSG324C: Spartan-6 LX 1.2V FPGA, 200 User I/Os, 324-Ball Chip-Scale BGA (0.8mm Pitch), Speed Grade 2, Commercial Grade, Pb-Free; FirstPublished: 17-Nov-2009; DatasheetVersion: ver1.3, Nov-2009; PackageVersion: ver1.0, Jun-2009; PackageReference: CSG324; Publisher: Altium Limited; PackageDescription: 324-Ball Chip-Scale BGA (CSG324) Package, 0.8 mm Pitch; Code_JEDEC: MO-275-KKAC-1; ComponentLink1Description: Spartan-6 Datasheet; ComponentLink1URL: http://www.xilinx.com/support/documentation/data_sheets/ds160.pdf; ComponentLink2Description: Pinout Specification; ComponentLink2URL: http://www.xilinx.com/support/documentation/user_guides/ug385.pdf; ComponentLink3Description: CSG324 Package Drawing; ComponentLink3URL: http://www.xilinx.com/support/documentation/package_specs/csg324.pdf; ComponentLink4Description: Spartan-6 Documents; ComponentLink4URL: http://www.xilinx.com/support/documentation/spartan-6.htm; ComponentLink5Description: Xilinx.com Home; ComponentLink5URL: http://www.xilinx.com

## Sheet 16gpio_misc.SchDoc
size B
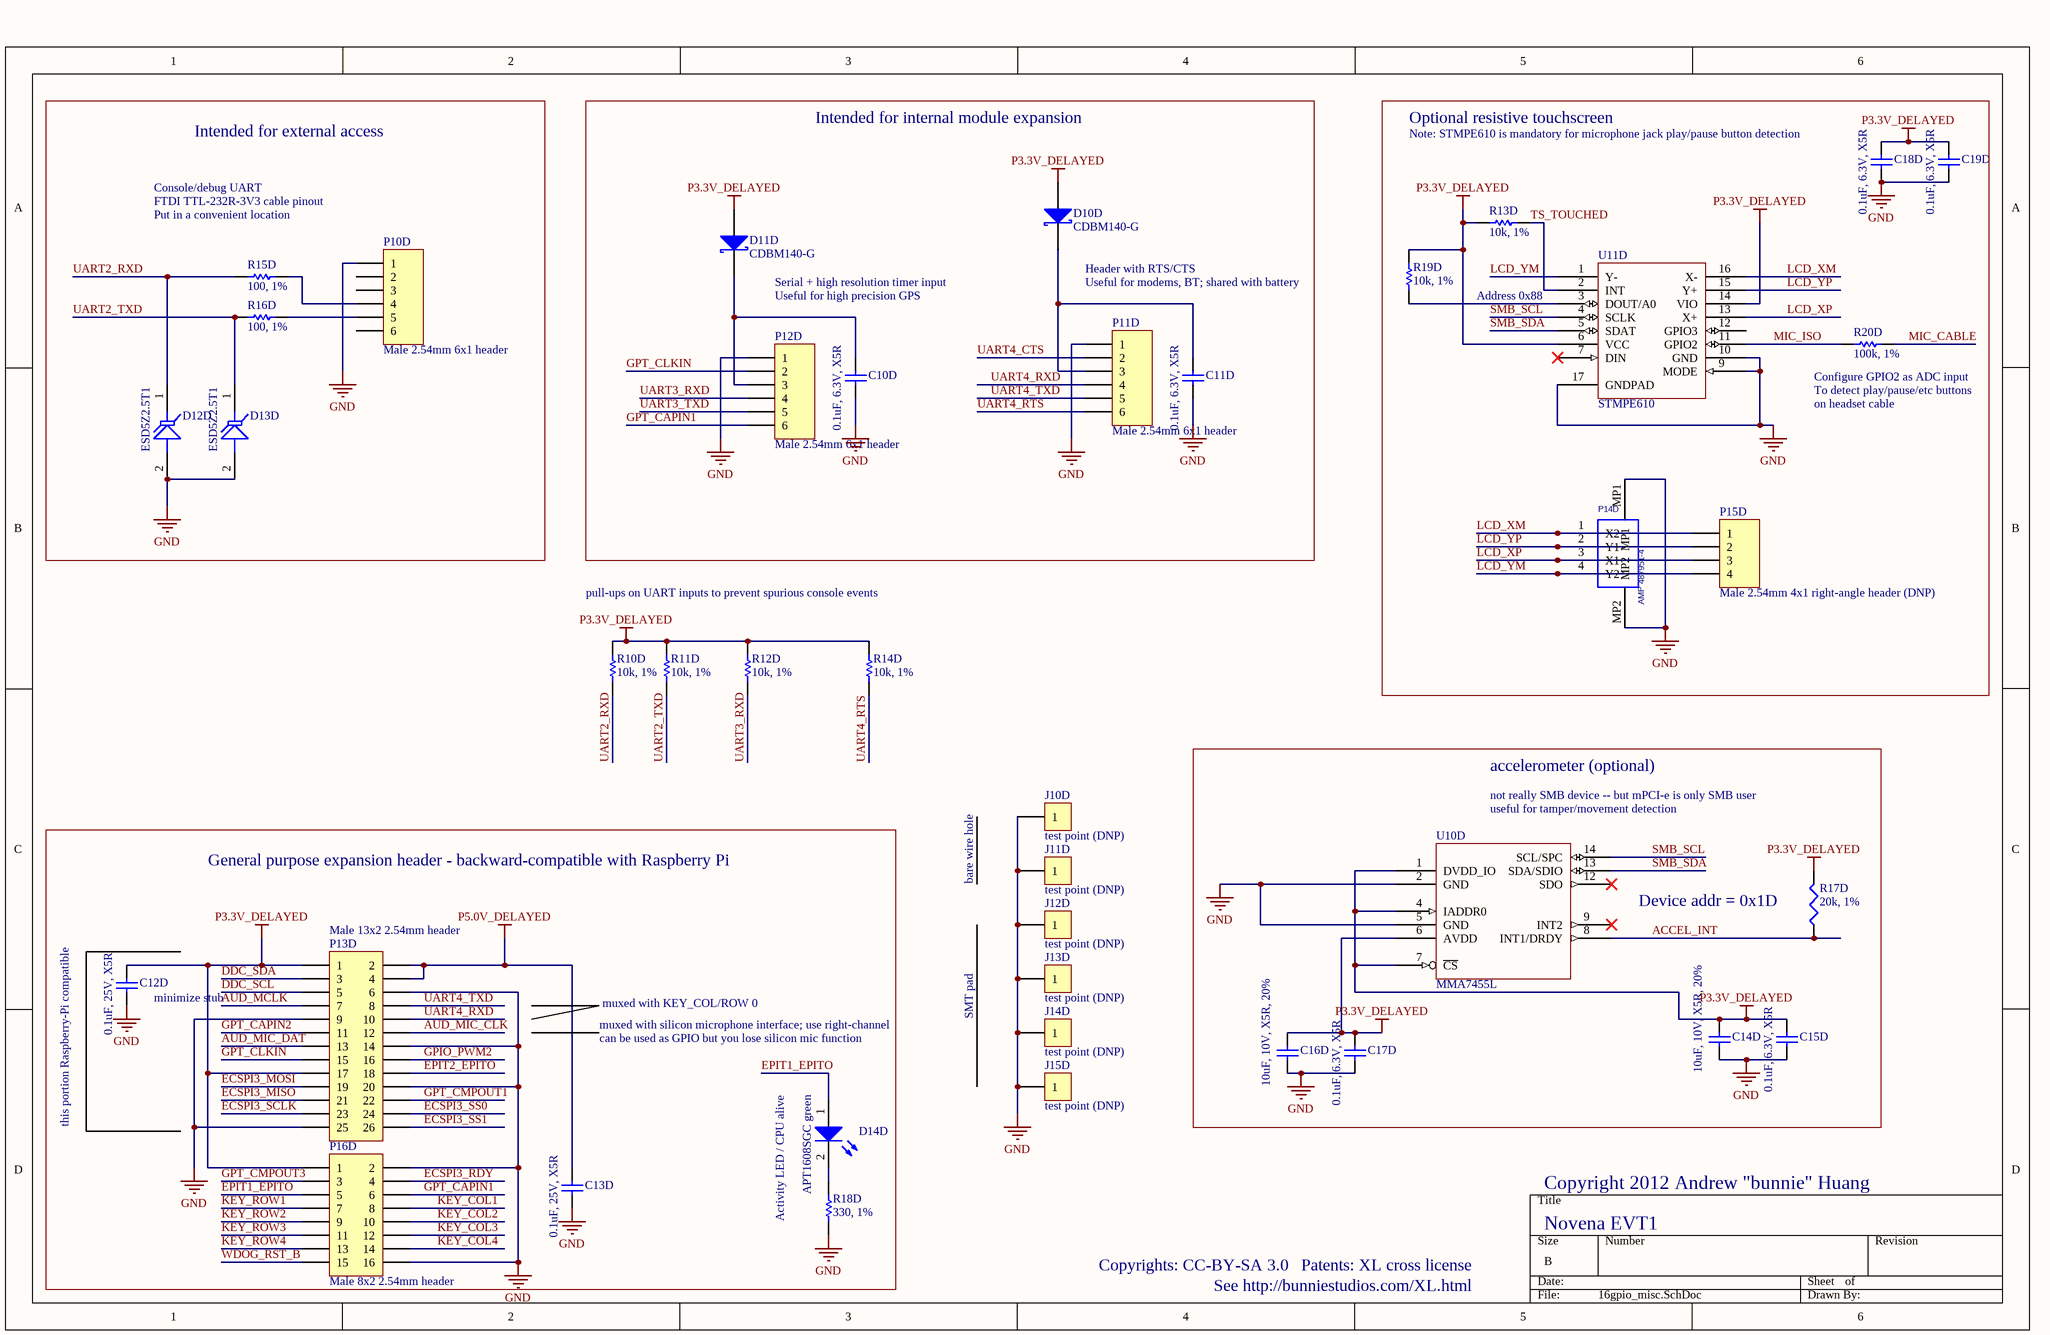
[diagram p18: 16gpio_misc.SchDoc]

### Parts
C10D  0.1uF, 6.3V, X5R  [CAPC0603N_B]
C11D  0.1uF, 6.3V, X5R  [CAPC0603N_B]
C12D  0.1uF, 25V, X5R  [CAPC1005N]
C13D  0.1uF, 25V, X5R  [CAPC1005N]
C14D  10uF, 10V, X5R, 20%  [CAPC1608N]
C15D  0.1uF, 6.3V, X5R  [CAPC0603N_B]
C16D  10uF, 10V, X5R, 20%  [CAPC1608N]
C17D  0.1uF, 6.3V, X5R  [CAPC0603N_B]
C18D  0.1uF, 6.3V, X5R  [CAPC0603N_B]
C19D  0.1uF, 6.3V, X5R  [CAPC0603N_B]
D10D  CDBM140-G  [SOD123]
D11D  CDBM140-G  [SOD123]
D12D  ESD5Z2.5T1  [SOD-523]
D13D  ESD5Z2.5T1  [SOD-523]
D14D  APT1608SGC green  [CD1608-0603]
J10D  test point (DNP)  [TP_HOLE]
J11D  test point (DNP)  [TP_HOLE]
J12D  test point (DNP)  [TP_SMT_38mil]
J13D  test point (DNP)  [TP_SMT_38mil]
J14D  test point (DNP)  [TP_SMT_38mil]
J15D  test point (DNP)  [TP_SMT_38mil]
P10D  Male 2.54mm 6x1 header  [HDR1X6]
P11D  Male 2.54mm 6x1 header  [HDR1X6]
P12D  Male 2.54mm 6x1 header  [HDR1X6]
P13D  Male 13x2 2.54mm header  [HDR2X13]
P14D  AMP 487951-4  [AMP_487951_4]
P15D  Male 2.54mm 4x1 right-angle header (DNP)  [HDR1X4H]
P16D  Male 8x2 2.54mm header  [HDR2X8]
R10D  10k, 1%  [RESC1005N]
R11D  10k, 1%  [RESC1005N]
R12D  10k, 1%  [RESC1005N]
R13D  10k, 1%  [RESC1005N]
R14D  10k, 1%  [RESC1005N]
R15D  100, 1%  [RESC1005N]
R16D  100, 1%  [RESC1005N]
R17D  20k, 1%  [RESC1005N]
R18D  330, 1%  [RESC1005N]
R19D  10k, 1%  [RESC1005N]
R20D  100k, 1%  [RESC1005N]
U10D  MMA7455L  [FREESCALE_LGA14_3mm_5mm]
U11D  STMPE610  [QFN50P300X300-16V2N]

### Blocks framed on the sheet
Intended for external access: D12D D13D P10D R15D R16D
Intended for internal module expansion: C10D C11D D10D D11D P11D P12D
Optional resistive touchscreen: C18D C19D P14D P15D R13D R19D R20D U11D

### Nets
GND: C10D.2 C11D.2 C12D.2 C13D.2 C14D.2 C15D.2 C16D.2 C17D.2 C18D.2 C19D.2 D12D.2(A) D13D.2(A) J10D.1 J11D.1 J12D.1 J13D.1 J14D.1 J15D.1 P10D.1 P11D.1 P12D.1 P13D.6 P13D.9 P13D.14 P13D.20 P13D.25 P14D.MP1 P14D.MP2 P16D.2 P16D.16 R18D.1 U10D.2(GND) U10D.5(GND) U11D.9(MODE) U11D.10(GND) U11D.17(GNDPAD)
P3.3V_DELAYED: C12D.1 C14D.1 C15D.1 C16D.1 C17D.1 C18D.1 C19D.1 D10D.1(A) D11D.1(A) P13D.1 P13D.17 P16D.1 R10D.1 R11D.1 R12D.1 R13D.2 R14D.1 R17D.2 R19D.1 U10D.1(DVDD_IO) U10D.4(IADDR0) U10D.6(AVDD) U10D.7(~{CS}) U11D.6(VCC) U11D.14(VIO)
P5.0V_DELAYED: C13D.1 P13D.2 P13D.4
ACCEL_INT: R17D.1 U10D.8(INT1/DRDY)
AUD_MCLK: P13D.7
AUD_MIC_CLK: P13D.12
AUD_MIC_DAT: P13D.13
DDC_SCL: P13D.5
DDC_SDA: P13D.3
ECSPI3_MISO: P13D.21
ECSPI3_MOSI: P13D.19
ECSPI3_RDY: P16D.4
ECSPI3_SCLK: P13D.23
ECSPI3_SS0: P13D.24
ECSPI3_SS1: P13D.26
EPIT1_EPITO: D14D.1(A) P16D.5
EPIT2_EPITO: P13D.18
GPIO_PWM2: P13D.16
GPT_CAPIN1: P12D.6 P16D.6
GPT_CAPIN2: P13D.11
GPT_CLKIN: P12D.2 P13D.15
GPT_CMPOUT1: P13D.22
GPT_CMPOUT3: P16D.3
KEY_COL1: P16D.8
KEY_COL2: P16D.10
KEY_COL3: P16D.12
KEY_COL4: P16D.14
KEY_ROW1: P16D.7
KEY_ROW2: P16D.9
KEY_ROW3: P16D.11
KEY_ROW4: P16D.13
LCD_XM: P14D.1(X2) P15D.1 U11D.16(X-)
LCD_XP: P14D.3(X1) P15D.3 U11D.13(X+)
LCD_YM: P14D.4(Y2) P15D.4 U11D.1(Y-)
LCD_YP: P14D.2(Y1) P15D.2 U11D.15(Y+)
MIC_CABLE: R20D.2
MIC_ISO: R20D.1 U11D.11(GPIO2)
SMB_SCL: U10D.14(SCL/SPC) U11D.4(SCLK)
SMB_SDA: U10D.13(SDA/SDIO) U11D.5(SDAT)
TS_TOUCHED: R13D.1 U11D.2(INT)
UART2_RXD: D12D.1(K) R10D.2 R15D.2
UART2_TXD: D13D.1(K) R11D.2 R16D.2
UART3_RXD: P12D.4 R12D.2
UART3_TXD: P12D.5
UART4_CTS: P11D.2
UART4_RTS: P11D.6 R14D.2
UART4_RXD: P11D.4 P13D.10
UART4_TXD: P11D.5 P13D.8
WDOG_RST_B: P16D.15
NetC10D_1: C10D.1 D11D.2(K) P12D.3
NetC11D_1: C11D.1 D10D.2(K) P11D.3
NetD14D_2: D14D.2(K) R18D.2
NetP10D_4: P10D.4 R15D.1
NetP10D_5: P10D.5 R16D.1
NetR19D_2: R19D.2 U11D.3(DOUT/A0)

Not connected (* = marked no-connect by the designer): P10D 2 3 6; U10D 9(INT2)* 12(SDO)*; U11D 7(DIN)* 12(GPIO3)

### Notes on the sheet
- (near C18D) Note: STMPE610 is mandatory for microphone jack play/pause button detection
- FTDI TTL-232R-3V3 cable pinout
- Console/debug UART
- Put in a convenient location
- Header with RTS/CTS
- Serial + high resolution timer input
- Useful for high precision GPS
- Useful for modems, BT; shared with battery
- Address 0x88
- (near R20D) Configure GPIO2 as ADC input
- (near R20D) To detect play/pause/etc buttons
- on headset cable
- pull-ups on UART inputs to prevent spurious console events
- not really SMB device -- but mPCI-e is only SMB user
- (near U10D) useful for tamper/movement detection
- accelerometer (optional)
- General purpose expansion header - backward-compatible with Raspberry Pi
- bare wire hole
- (near R17D) Device addr = 0x1D
- (near C12D) minimize stub
- muxed with KEY_COL/ROW 0
- SMT pad
- muxed with silicon microphone interface; use right-channel
- can be used as GPIO but you lose silicon mic function
- this portion Raspberry-Pi compatible
- Activity LED / CPU alive
- Copyright 2012 Andrew "bunnie" Huang
- Copyrights: CC-BY-SA 3.0
- Patents: XL cross license
- Novena EVT1
- See http://bunniestudios.com/XL.html

### Library data of the parts
C10D C11D C12D C13D C14D C15D C16D C17D C18D C19D = Cap Semi: Capacitor (Semiconductor SIM Model); Published: 8-Jun-2000; LatestRevisionDate: 17-Jul-2002; LatestRevisionNote: Re-released for DXP Platform.; PackageReference: C1206; Publisher: Altium Limited
D10D D11D = D Schottky: Schottky Diode; Code - JEDEC: DO-214-AA; Published: 8-Jun-2000; Publisher: Altium Limited; Revision: July-2002: Re-released for DXP Platform.
D12D D13D = Tranzorb: On Semi 3.3V standoff TVS diode; Published: 24-Mar-1999; LatestRevisionDate: 17-Jul-2002; LatestRevisionNote: Re-released for DXP Platform.; PackageReference: DO-7; Publisher: Altium Limited
D14D = LED2: as D10F on sheet 15fpga; Published: 8-Jun-2000; LatestRevisionDate: 17-Jul-2002; LatestRevisionNote: Re-released for DXP Platform.; PackageVersion: Feb-2002; PackageReference: 3.2X1.6X1.1; Publisher: Altium Limited
J10D J11D J12D J13D J14D J15D = CON1: Connector
P10D P11D P12D = Header 6: Header, 6-Pin; LatestRevisionDate: 17-Jul-2002; LatestRevisionNote: Re-released for DXP Platform.; Publisher: Altium Limited
P13D = Header 13X2: Header, 13-Pin, Dual row; LatestRevisionDate: 17-Jul-2002; LatestRevisionNote: Re-released for DXP Platform.; Publisher: Altium Limited
P14D = TFT_TP_CON: Right: 30; Bottom: 50
P15D = Header 4H: Header, 4-Pin, Right Angle; LatestRevisionDate: 17-Jul-2002; LatestRevisionNote: Re-released for DXP Platform.; Publisher: Altium Limited
P16D = Header 8X2: Header, 8-Pin, Dual row; LatestRevisionDate: 17-Jul-2002; LatestRevisionNote: Re-released for DXP Platform.; Publisher: Altium Limited
R10D R11D R12D R13D R14D R15D R16D R18D R19D = Res1: Resistor; Value: 100k; Published: 8-Jun-2000; LatestRevisionDate: 17-Jul-2002; LatestRevisionNote: Re-released for DXP Platform.; PackageReference: AXIAL-0.3; Publisher: Altium Limited
R17D = Res3: Resistor; Published: 8-Jun-2000; LatestRevisionDate: 4-Mar-2005; LatestRevisionNote: PCB Footprint replaced.; Publisher: Altium Limited
R20D = Res1: Resistor; Published: 8-Jun-2000; LatestRevisionDate: 17-Jul-2002; LatestRevisionNote: Re-released for DXP Platform.; PackageReference: AXIAL-0.3; Publisher: Altium Limited; Value: 100k
U10D = FREESCALE_MMA7455L: 3-axis accelerometer, 10 bit, selectable g-range
U11D = STMPE610: 4-wire resistive touchscreen controller

## Nets that join several sheets
GND: 02cpu_power (190 pins), 03cpu_sodimm (104 pins), 04pwr_pmic (59 pins), 05pwr_input (55 pins), 06cpu_soc (40 pins), 07sdcard (13 pins), 08usb (88 pins), 09sata (18 pins), 10ethernet100 (47 pins), 11ethernetGbit (38 pins), 12mPCIe (32 pins), 13hdmi_lcd (44 pins), 14audio (43 pins), 15fpga (160 pins), 16gpio_misc (36 pins)
P0.75V_REFDDR: 03cpu_sodimm (10 pins), 04pwr_pmic (C19P.1 U200.31)
P1.5V_DDR_SW3: 03cpu_sodimm (64 pins), 04pwr_pmic (8 pins)
P1.5V_VGEN2: 04pwr_pmic (C11P.1 U200.18), 12mPCIe (5 pins)
P1.8V_SW4: 03cpu_sodimm (R16M.1), 04pwr_pmic (C42P.1 L13P.2 U200.19)
P1.8V_VGEN3: 04pwr_pmic (C12P.1 U200.26), 14audio (R24A.2)
P2.5V_VGEN5: 02cpu_power (8 pins), 04pwr_pmic (C15P.1 D10P.1 U200.39), 05pwr_input (Q11N.1), 11ethernetGbit (9 pins)
P2.8V_VGEN6: 04pwr_pmic (C16P.1 U200.41), 05pwr_input (Q13N.1)
P3.0V_STBY: 02cpu_power (C71C.1 D10C.2 U100.G11), 04pwr_pmic (C24P.1 R11P.2 R13P.2 U200.43), 06cpu_soc (5 pins)
P3.0V_VDDHIGH_SW2: 02cpu_power (5 pins), 04pwr_pmic (6 pins)
P3.3V: 04pwr_pmic (31 pins), 05pwr_input (10 pins), 13hdmi_lcd (5 pins)
P3.3V_DELAYED: 02cpu_power (20 pins), 03cpu_sodimm (C17M.1 JP10M.199 R12M.1), 04pwr_pmic (C17P.1 R14P.2 U200.27), 05pwr_input (7 pins), 06cpu_soc (13 pins), 07sdcard (8 pins), 08usb (24 pins), 09sata (7 pins), 10ethernet100 (14 pins), 11ethernetGbit (8 pins), 12mPCIe (7 pins), 13hdmi_lcd (8 pins), 14audio (10 pins), 15fpga (107 pins), 16gpio_misc (25 pins)
P5.0V: 03cpu_sodimm (R13M.1), 05pwr_input (19 pins)
P5.0V_DELAYED: 05pwr_input (Q10N.5 Q10N.6 Q10N.7 Q10N.8), 08usb (12 pins), 09sata (5 pins), 10ethernet100 (R10E.1), 11ethernetGbit (C29G.1 U11G.4 U11G.5), 13hdmi_lcd (5 pins), 14audio (C18A.2 C27A.2 U10A.6 U12A.6), 15fpga (8 pins), 16gpio_misc (C13D.1 P13D.2 P13D.4)
P5.0V_SWBST: 04pwr_pmic (C49P.1 D11P.2 U200.44), 08usb (R25U.2)
VANA: 14audio (R28A.2), 15fpga (15 pins)
VCC_1.2V_SW1AB: 02cpu_power (32 pins), 04pwr_pmic (6 pins)
VDD_HIGH_CAP: 02cpu_power (8 pins), 09sata (C20H.1 C21H.1 U100.G12), 12mPCIe (C27X.1 C28X.1 U100.G7), 13hdmi_lcd (5 pins)
VDD_SOC_IN_SW1C: 02cpu_power (20 pins), 04pwr_pmic (C40P.1 C41P.1 L12P.1 U200.13)
VDDSOC_CAP: 02cpu_power (18 pins), 09sata (C15H.1 C16H.1 U100.G13), 12mPCIe (C19X.1 C20X.1 L10X.1 U100.H7), 13hdmi_lcd (C20L.1 C21L.1 U100.L7)
ACCEL_INT: 13hdmi_lcd (U100.V25), 16gpio_misc (R17D.1 U10D.8)
AUD6_TFS: 13hdmi_lcd (U100.N20), 15fpga (U800.A4)
AUD6_TXC: 13hdmi_lcd (U100.N21), 15fpga (U800.B4)
AUD6_TXD: 13hdmi_lcd (U100.N25), 15fpga (U800.A6)
AUD_CLK: 13hdmi_lcd (R10L.2), 14audio (U11A.5)
AUD_DIN: 13hdmi_lcd (U100.N3), 14audio (U11A.8)
AUD_DOUT: 13hdmi_lcd (U100.P2), 14audio (U11A.6)
AUD_HP_IN: 13hdmi_lcd (U100.T20), 14audio (C34A.2 R16A.2)
AUD_LRCLK: 13hdmi_lcd (U100.N4), 14audio (U11A.7 U11A.9)
AUD_MCLK: 07sdcard (R16S.1), 13hdmi_lcd (R26L.2), 14audio (R29A.1 R32A.2 U11A.1), 15fpga (U800.K16), 16gpio_misc (P13D.7)
AUD_MIC_CLK: 13hdmi_lcd (U100.R23), 14audio (P12A.3 R31A.1 R34A.2 U13A.3), 15fpga (U800.G3), 16gpio_misc (P13D.12)
AUD_MIC_DAT: 13hdmi_lcd (U100.P25), 14audio (P12A.2 U13A.4), 15fpga (U800.C5), 16gpio_misc (P13D.13)
AUD_PWRON: 13hdmi_lcd (U100.W24), 14audio (Q10A.1 R19A.1 U10A.1 U12A.1)
BATT_NRST: 05pwr_input (D16N.1 R22N.2), 13hdmi_lcd (U100.N2), 15fpga (U800.N1)
BATT_PWR: 05pwr_input (16 pins), 13hdmi_lcd (5 pins)
BATT_REFLASH_ALRT: 05pwr_input (D15N.1 R21N.1 R23N.2), 13hdmi_lcd (U100.P3), 15fpga (U800.N2)
CEC: 06cpu_soc (U100.H19), 13hdmi_lcd (D10L.1 D10L.10 R31L.2 U100.K2)
CLK2_N: 06cpu_soc (R57B.2 U100.C5), 15fpga (U800.L16)
CLK2_P: 06cpu_soc (R57B.1 U100.D5), 15fpga (U800.L15)
CPU_TAMPER: 06cpu_soc (P_TAMPER.2 R28B.2 U100.E11), 15fpga (R26F.2)
DDC_SCL: 04pwr_pmic (U200.54), 06cpu_soc (U100.E22), 13hdmi_lcd (Q15L.2 R20L.2), 15fpga (U800.U17), 16gpio_misc (P13D.5)
DDC_SDA: 04pwr_pmic (U200.53), 06cpu_soc (U100.C25), 13hdmi_lcd (Q16L.2 R23L.2), 15fpga (U800.U18), 16gpio_misc (P13D.3)
ECSPI3_MISO: 13hdmi_lcd (U100.P23), 15fpga (U800.A3), 16gpio_misc (P13D.21)
ECSPI3_MOSI: 13hdmi_lcd (U100.P22), 15fpga (U800.A2 U800.R13), 16gpio_misc (P13D.19)
ECSPI3_RDY: 13hdmi_lcd (U100.R24), 15fpga (U800.A5), 16gpio_misc (P16D.4)
ECSPI3_SCLK: 13hdmi_lcd (U100.P24), 15fpga (R10F.2 R11F.1 U800.D9 U800.R15), 16gpio_misc (P13D.23)
ECSPI3_SS0: 13hdmi_lcd (U100.P21), 16gpio_misc (P13D.24)
ECSPI3_SS1: 13hdmi_lcd (U100.P20), 16gpio_misc (P13D.26)
ECSPI3_SS2: 13hdmi_lcd (U100.R25), 15fpga (U800.B3)
EIM_A16: 06cpu_soc (U100.H25), 15fpga (U800.A11)
EIM_A17: 06cpu_soc (U100.G24), 15fpga (U800.B12)
EIM_A18: 06cpu_soc (U100.J22), 15fpga (U800.D14)
EIM_BCLK: 06cpu_soc (U100.N22), 15fpga (U800.C9)
EIM_CS0: 06cpu_soc (U100.H24), 15fpga (U800.B11)
EIM_CS1: 06cpu_soc (U100.J23), 15fpga (U800.A15)
EIM_DA0: 06cpu_soc (R50B.1 U100.L20), 15fpga (U800.G9)
EIM_DA1: 06cpu_soc (R37B.1 U100.J25), 15fpga (U800.A10)
EIM_DA2: 06cpu_soc (R49B.1 U100.L21), 15fpga (U800.F9)
EIM_DA3: 06cpu_soc (R48B.1 U100.K24), 15fpga (U800.B9)
EIM_DA4: 06cpu_soc (R36B.2 R47B.1 U100.L22), 15fpga (U800.E13)
EIM_DA5: 06cpu_soc (R38B.1 U100.L23), 15fpga (U800.F13)
EIM_DA6: 06cpu_soc (R40B.1 U100.K25), 15fpga (U800.A9)
EIM_DA7: 06cpu_soc (R46B.1 U100.L25), 15fpga (U800.A8)
EIM_DA8: 06cpu_soc (R55B.1 U100.L24), 15fpga (U800.B8)
EIM_DA9: 06cpu_soc (R54B.1 U100.M21), 15fpga (U800.D8)
EIM_DA10: 06cpu_soc (R53B.1 U100.M22), 15fpga (U800.D11)
EIM_DA11: 06cpu_soc (R42B.1 U100.M20), 15fpga (U800.C8)
EIM_DA12: 06cpu_soc (R44B.1 U100.M24), 15fpga (U800.C7)
EIM_DA13: 06cpu_soc (R35B.2 U100.M23), 15fpga (U800.C11)
EIM_DA14: 06cpu_soc (R52B.1 U100.N23), 15fpga (U800.C4)
EIM_DA15: 06cpu_soc (R51B.1 U100.N24), 15fpga (U800.B6)
EIM_LBA: 06cpu_soc (U100.K22), 15fpga (U800.B14)
EIM_OE: 06cpu_soc (U100.J24), 15fpga (U800.C10)
EIM_RW: 06cpu_soc (U100.K20), 15fpga (U800.C14)
EIM_WAIT: 06cpu_soc (U100.M25), 15fpga (U800.A7)
EPIT1_EPITO: 06cpu_soc (U100.G21), 15fpga (U800.H12), 16gpio_misc (D14D.1 P16D.5)
EPIT2_EPITO: 06cpu_soc (U100.G20), 16gpio_misc (P13D.18)
FPGA_DONE: 13hdmi_lcd (U100.T24), 15fpga (D10F.2 U800.V17)
FPGA_INIT_N: 13hdmi_lcd (U100.T23), 15fpga (R21F.2 U800.U3)
FPGA_RESET_N: 13hdmi_lcd (U100.R20), 15fpga (R25F.1 U11F.6 U800.V2)
FPGA_SUSPEND: 13hdmi_lcd (U100.R21), 15fpga (R23F.2 U800.R16)
FPGA_TCK: 13hdmi_lcd (U100.U25), 15fpga (P10F.2 U800.A17)
FPGA_TDI: 13hdmi_lcd (U100.T22), 15fpga (P10F.3 U800.D15)
FPGA_TDO: 13hdmi_lcd (U100.T21), 15fpga (P10F.4 U800.D16)
FPGA_TMS: 13hdmi_lcd (U100.U24), 15fpga (P10F.5 U800.B18)
GPIO_PWM2: 13hdmi_lcd (U100.T25), 16gpio_misc (P13D.16)
GPT_CAPIN1: 07sdcard (U100.A21), 16gpio_misc (P12D.6 P16D.6)
GPT_CAPIN2: 07sdcard (U100.C20), 16gpio_misc (P13D.11)
GPT_CLKIN: 07sdcard (U100.D20), 16gpio_misc (P12D.2 P13D.15)
GPT_CMPOUT1: 07sdcard (U100.B21), 16gpio_misc (P13D.22)
GPT_CMPOUT3: 07sdcard (U100.F18), 16gpio_misc (P16D.3)
HDMI_HPD_CPU: 06cpu_soc (U100.F25), 13hdmi_lcd (R27L.1 R28L.1 U100.K1)
I2C3_SCL: 06cpu_soc (U100.F21), 07sdcard (U10S.6), 13hdmi_lcd (JP10L.28), 14audio (R26A.2), 15fpga (U800.P4)
I2C3_SDA: 06cpu_soc (U100.D24), 07sdcard (U10S.5), 13hdmi_lcd (JP10L.29), 14audio (R27A.2), 15fpga (U800.P3)
KEY_COL1: 07sdcard (U100.U7), 16gpio_misc (P16D.8)
KEY_COL2: 07sdcard (U100.W6), 16gpio_misc (P16D.10)
KEY_COL3: 07sdcard (U100.U5), 16gpio_misc (P16D.12)
KEY_COL4: 07sdcard (SW10S.1 SW10S.2 U100.T6), 16gpio_misc (P16D.14)
KEY_ROW1: 07sdcard (U100.U6), 16gpio_misc (P16D.7)
KEY_ROW2: 07sdcard (U100.W4), 16gpio_misc (P16D.9)
KEY_ROW3: 07sdcard (U100.T7), 16gpio_misc (P16D.11)
KEY_ROW4: 07sdcard (SW10S.3 SW10S.4 U100.V5), 16gpio_misc (P16D.13)
MIC_CABLE: 14audio (5 pins), 16gpio_misc (R20D.2)
OTG_ID: 07sdcard (U100.W23), 08usb (D15U.1 R41U.1 R42U.1)
PCIE_CLKREQ_N: 12mPCIe (JP10X.7 R23X.1), 13hdmi_lcd (U100.U22)
PCIE_REFCLK_N: 06cpu_soc (U100.C7), 12mPCIe (C17X.2)
PCIE_REFCLK_P: 06cpu_soc (U100.D7), 12mPCIe (C18X.2)
PCIE_RST: 06cpu_soc (U100.J19), 12mPCIe (JP10X.22 R16X.2)
PCIE_WAKE: 06cpu_soc (U100.E23), 12mPCIe (J10X.1 JP10X.1)
PCIE_WDIS_N: 06cpu_soc (U100.F24), 12mPCIe (JP10X.20)
PMIC_INT_B: 04pwr_pmic (R14P.1 U200.1), 13hdmi_lcd (U100.V24)
PMIC_ON_REQ: 04pwr_pmic (R12P.2), 06cpu_soc (U100.D11)
PMIC_STBY_REQ: 04pwr_pmic (U200.4), 06cpu_soc (U100.F11)
RESETBMCU: 04pwr_pmic (U200.3), 05pwr_input (U13N.A1), 06cpu_soc (6 pins), 08usb (U10U.26 U13U.26), 15fpga (Q10F.3 U800.K18)
RGMII_INT: 07sdcard (U100.P5 U100.V21), 11ethernetGbit (R11G.1 U10G.38)
RGMII_MDC: 07sdcard (U100.V20), 11ethernetGbit (U10G.36)
RGMII_MDIO: 07sdcard (U100.V23), 11ethernetGbit (R13G.1 U10G.37)
RGMII_NRST: 06cpu_soc (U100.D25), 11ethernetGbit (D12G.2)
RGMII_REF_CLK: 07sdcard (U100.V22), 11ethernetGbit (R21G.2)
SATA_PWRON: 06cpu_soc (U100.J20), 09sata (Q11H.1 R12H.2)
SMB_SCL: 03cpu_sodimm (JP10M.202), 06cpu_soc (U100.H20), 12mPCIe (JP10X.30 R21X.1), 13hdmi_lcd (U100.N5), 15fpga (U800.N3), 16gpio_misc (U10D.14 U11D.4)
SMB_SDA: 03cpu_sodimm (JP10M.200), 06cpu_soc (U100.G23), 12mPCIe (JP10X.32 R22X.1), 13hdmi_lcd (U100.N6), 15fpga (U800.N4), 16gpio_misc (U10D.13 U11D.5)
TS_TOUCHED: 13hdmi_lcd (U100.U23), 16gpio_misc (R13D.1 U11D.2)
UART2_RXD: 06cpu_soc (U100.E25), 16gpio_misc (D12D.1 R10D.2 R15D.2)
UART2_TXD: 06cpu_soc (U100.E24), 16gpio_misc (D13D.1 R11D.2 R16D.2)
UART3_RXD: 06cpu_soc (U100.G22), 15fpga (U800.P2), 16gpio_misc (P12D.4 R12D.2)
UART3_TXD: 06cpu_soc (U100.F22), 15fpga (U800.T2), 16gpio_misc (P12D.5)
UART4_CTS: 13hdmi_lcd (U100.L3), 15fpga (U800.U1), 16gpio_misc (P11D.2)
UART4_RTS: 13hdmi_lcd (U100.L4), 15fpga (U800.U2), 16gpio_misc (P11D.6 R14D.2)
UART4_RXD: 05pwr_input (D13N.1 R27N.2 R30N.2), 07sdcard (U100.V6), 13hdmi_lcd (U100.L1), 15fpga (U800.T1), 16gpio_misc (P11D.4 P13D.10)
UART4_TXD: 05pwr_input (D14N.1 R26N.2 R28N.2), 07sdcard (U100.W5), 13hdmi_lcd (U100.M2), 15fpga (U800.P1), 16gpio_misc (P11D.5 P13D.8)
UIM_CLK: 06cpu_soc (U100.H22), 12mPCIe (JP10X.12 U10X.C3), 15fpga (U800.B16)
UIM_DATA: 06cpu_soc (U100.G25), 12mPCIe (JP10X.10 U10X.C7), 15fpga (U800.A12)
UIM_PWR: 12mPCIe (C16X.1 JP10X.8 Q12X.3 U10X.C1), 15fpga (U800.J18)
UIM_PWRON: 06cpu_soc (U100.J21), 12mPCIe (Q12X.1 R14X.2), 15fpga (U800.A14)
UIM_RESET: 06cpu_soc (U100.H23), 12mPCIe (JP10X.14 U10X.C2), 15fpga (U800.C15)
USB_ETH_N: 08usb (U10U.9), 10ethernet100 (R11E.1)
USB_ETH_P: 08usb (U10U.10), 10ethernet100 (R13E.1)
USB_OVERCUR5_N: 08usb (U13U.42), 13hdmi_lcd (R12L.1 U10L.3)
USB_PCI_N: 08usb (U10U.21), 12mPCIe (JP10X.36)
USB_PCI_P: 08usb (U10U.22), 12mPCIe (JP10X.38)
USB_PWREN5_N: 08usb (U13U.43), 13hdmi_lcd (U10L.1)
USB_VID_N: 08usb (U13U.5), 13hdmi_lcd (JP10L.39)
USB_VID_P: 08usb (U13U.6), 13hdmi_lcd (JP10L.40)
WDOG_RST_B: 07sdcard (U100.E19), 15fpga (U800.U16), 16gpio_misc (P16D.15)